# EasyEDA Pro project 温度报警器.eprj

# Schematic Schematic1
Create Date: 2024-07-26; Page Name: P1; Project Name: 温度报警器; Schematic Name: Schematic1; Update Date: 2024-07-29; Company: 嘉立创EDA; Page Size: A4; Version: V1.0
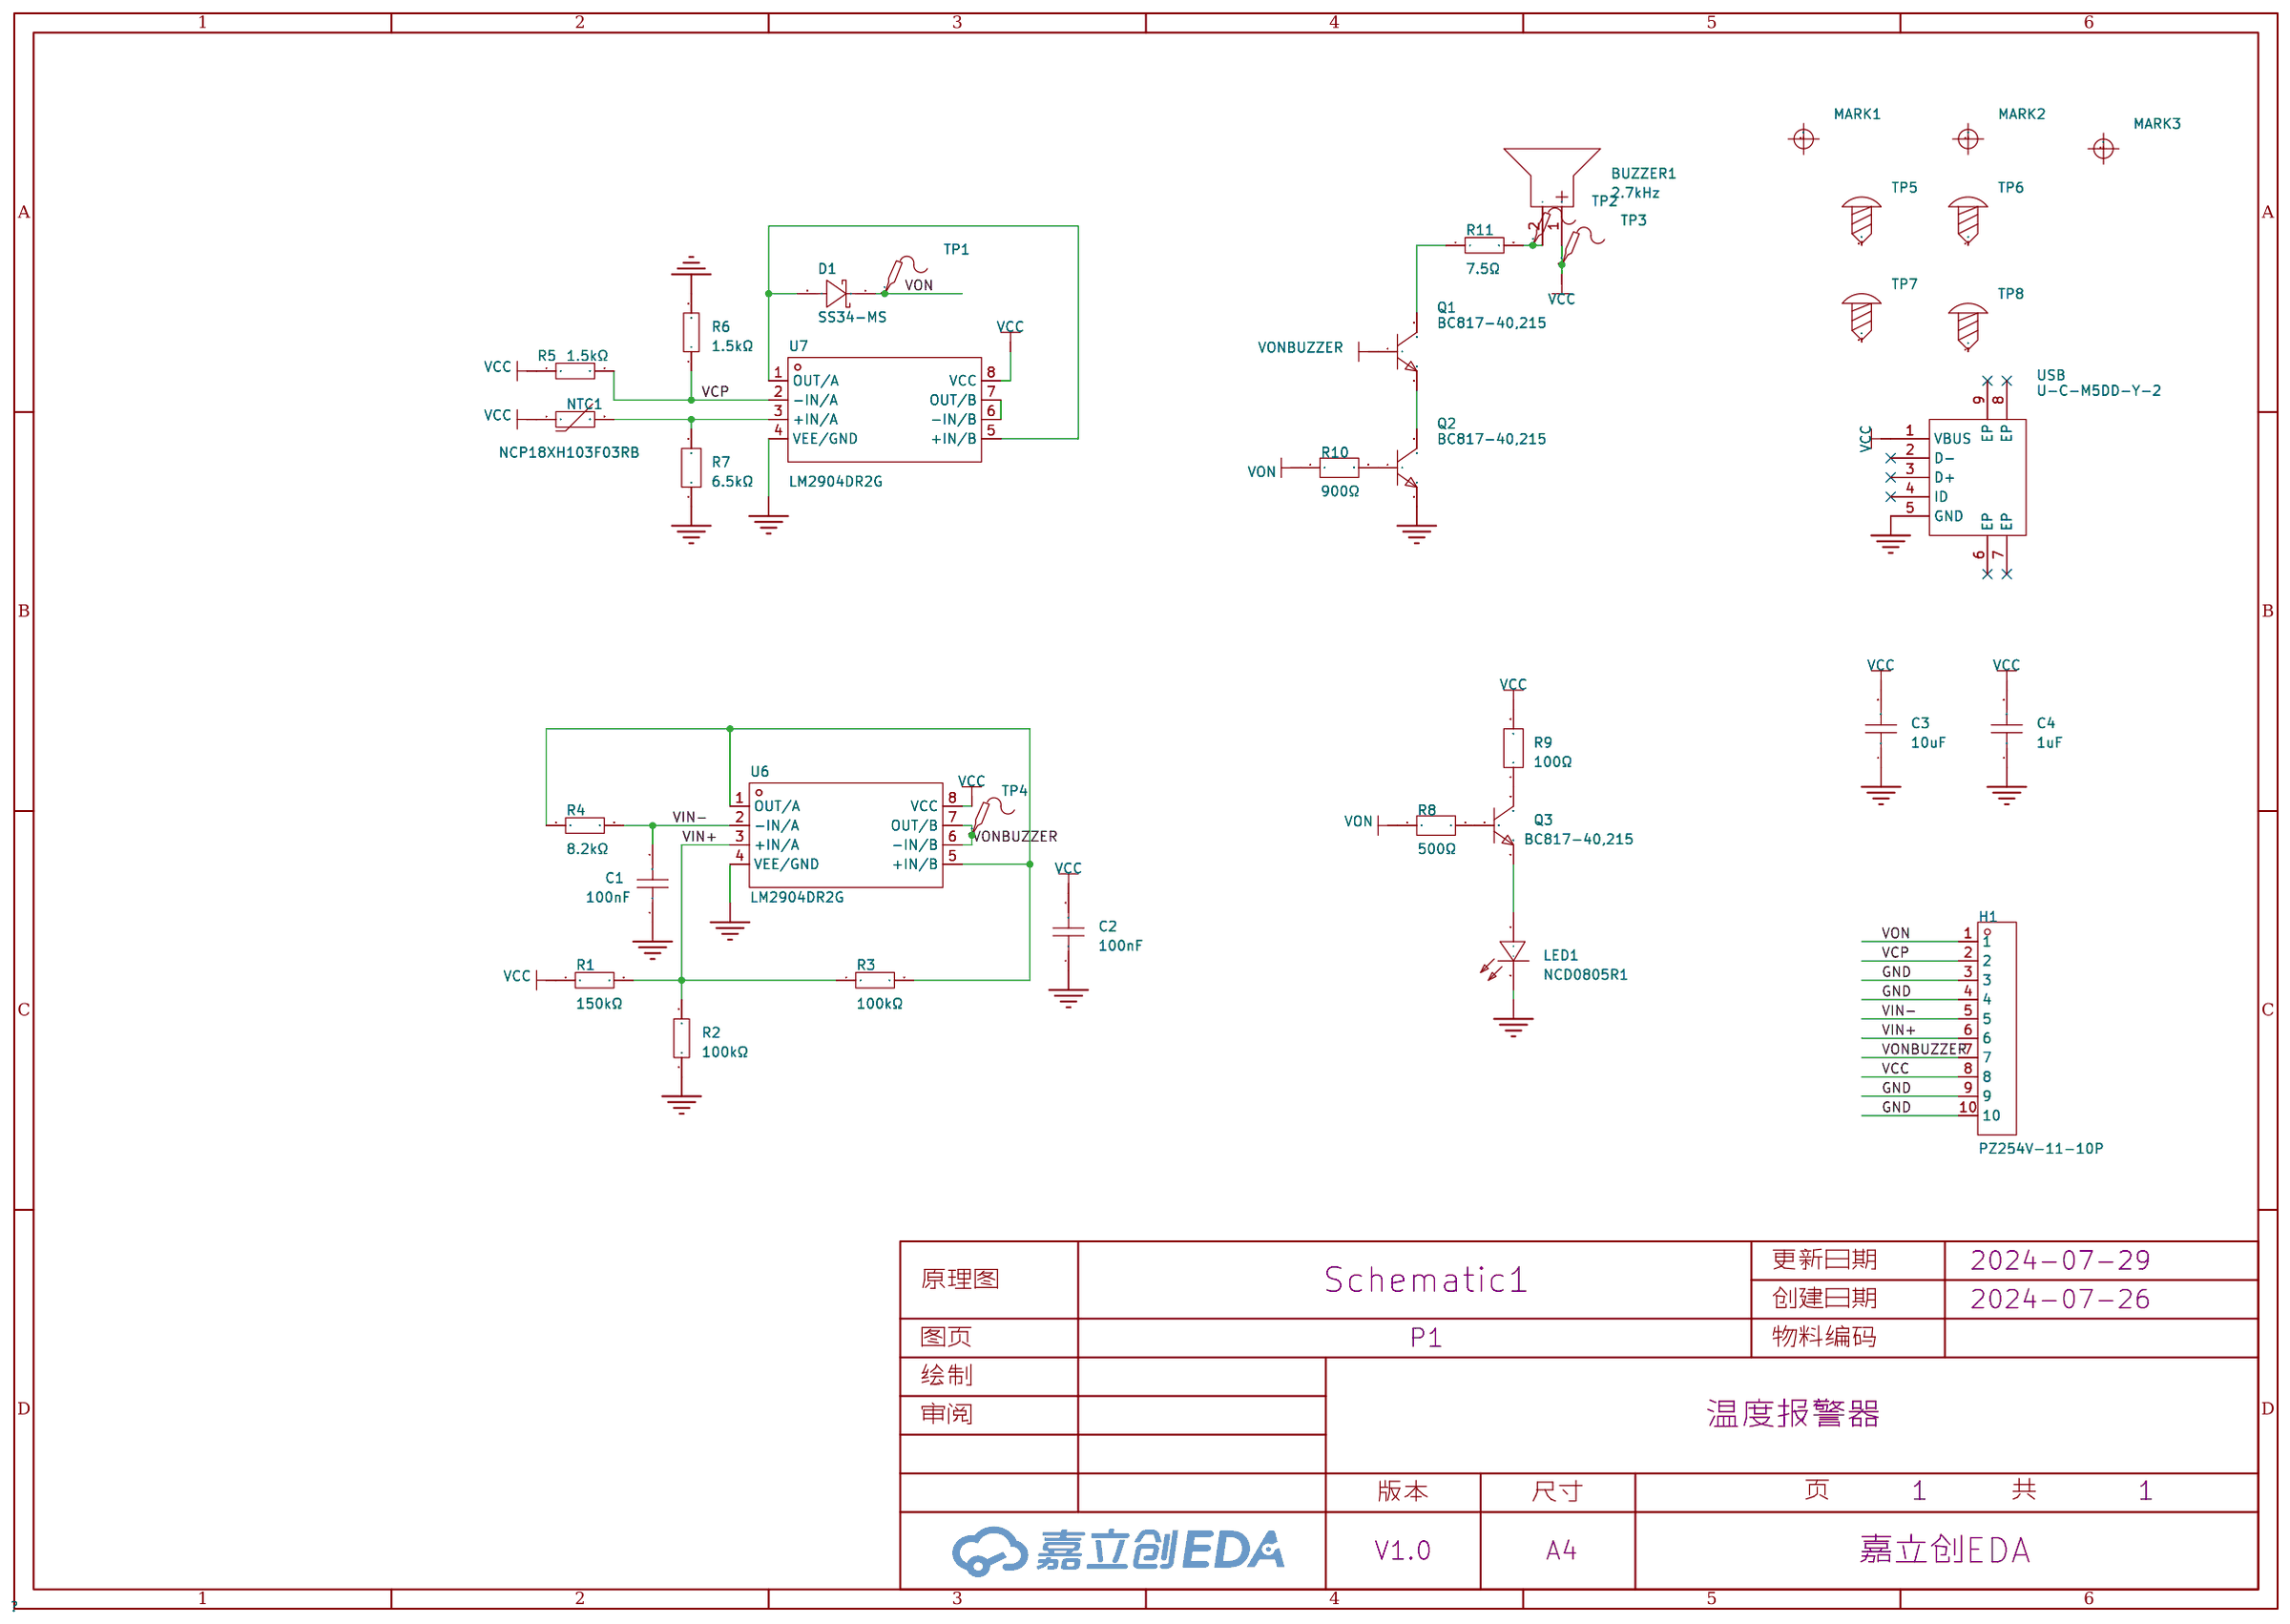
[diagram p0: schematic sheet]

## Parts
BUZZER1  2.7kHz  [BUZ-TH_BD9.0-P4.00-D0.6-FD]
C1  100nF  [C0603]
C2  100nF  [C0603]
C3  10uF  [C0603]
C4  1uF  [C0603]
D1  SS34-MS  [DO-214AC_L4.3-W2.7-LS5.0-RD]
H1  PZ254V-11-10P  [HDR-TH_10P-P2.54-V-M]
LED1  NCD0805R1  [LED0805-R-RD]
MARK1  -  [Mark-Point-1mm]  (no BOM)
MARK2  -  [Mark-Point-1mm]  (no BOM)
MARK3  -  [Mark-Point-1mm]  (no BOM)
NTC1  NCP18XH103F03RB  [R0603]
Q1  BC817-40,215  [SOT-23-3_L2.9-W1.6-P1.90-LS2.8-BR]
Q2  BC817-40,215  [SOT-23-3_L2.9-W1.6-P1.90-LS2.8-BR]
Q3  BC817-40,215  [SOT-23-3_L2.9-W1.6-P1.90-LS2.8-BR]
R1  150kΩ  [R0603]
R2  100kΩ  [R0603]
R3  100kΩ  [R0603]
R4  8.2kΩ  [R0603]
R5  1.5kΩ  [R0603]
R6  1.5kΩ  [R0603]
R7  6.5kΩ  [R0603]
R8  500Ω  [R0603]
R9  100Ω  [R0805]
R10  900Ω  [R0603]
R11  7.5Ω  [R1210]
TP1  -  [Test-Point-0.5mm]
TP2  -  [Test-Point-0.5mm]
TP3  -  [Test-Point-0.5mm]
TP4  -  [Test-Point-0.5mm]
TP5  -  [M3螺丝]
TP6  -  [M3螺丝]
TP7  -  [M3螺丝]
TP8  -  [M3螺丝]
U6  LM2904DR2G  [SOIC-8_L4.9-W3.9-P1.27-LS6.0-BL]
U7  LM2904DR2G  [SOIC-8_L4.9-W3.9-P1.27-LS6.0-BL]
USB  U-C-M5DD-Y-2  [MICRO-USB-SMD_U-C-M5DD-Y-2]

## Library data of the parts
BUZZER1 = YS-MBZ9042C05R42: 驱动方式:无源(外部驱动);构造类型:电磁式;频率:2.7kHz;声压(SPL):85dB@5V,10cm;; LCSC Part Name: 电磁式无源蜂鸣器5V; Supplier Part: C409837; Manufacturer: Fengming(锋鸣电子); Supplier Footprint: 插件,D=9mm; JLCPCB Part Class: 扩展库; Datasheet: https://atta.szlcsc.com/upload/public/pdf/source/20191217/C409837_893ADB678ED7E25111BC2D1A287FE6B1.pdf; Supplier: LCSC; Oscillator Circuit: 无源(外部驱动); Technology Type: 电磁式; Operating Voltage: 3V~7V; Sound Pressure Level (SPL): 85dB@5V,10cm; Diameter (φD): 9mm; Height: 4.4mm
C1 C2 = CC0603KRX7R9BB104: 容值:100nF;精度:±10%;额定电压:50V;材质(温度系数):X7R;; LCSC Part Name: 100nF ±10% 50V; Supplier Part: C14663; Manufacturer: YAGEO(国巨); Supplier Footprint: 0603; JLCPCB Part Class: Basic Part; Datasheet: https://atta.szlcsc.com/upload/public/pdf/source/20180910/C282072_33301C7F631E79921B82A8DAC6BCC5B3.pdf; Supplier: LCSC; Tolerance: ±10%; Voltage Rated: 50V; Temperature Coefficient: X7R
C3 = CL10A106KP8NNNC: 容值:10uF;精度:±10%;额定电压:10V;材质(温度系数):X5R;; LCSC Part Name: 10uF ±10% 10V; Supplier Part: C19702; Manufacturer: SAMSUNG(三星); Supplier Footprint: 0603; JLCPCB Part Class: 基础库; Datasheet: https://atta.szlcsc.com/upload/public/pdf/source/20160218/1457707763339.pdf; Supplier: LCSC; Tolerance: ±10%; Voltage Rated: 10V; Temperature Coefficient: X5R
C4 = CL10A105KB8NNNC: 容值:1uF;精度:±10%;额定电压:50V;材质(温度系数):X5R;; LCSC Part Name: 1uF ±10% 50V; Supplier Part: C15849; Manufacturer: SAMSUNG(三星); Supplier Footprint: 0603; JLCPCB Part Class: Basic Part; Datasheet: https://atta.szlcsc.com/upload/public/pdf/source/20160218/1457707763339.pdf; Supplier: LCSC; Tolerance: ±10%; Voltage Rated: 50V; Temperature Coefficient: X5R
D1 = SS34-MS: 二极管配置:-;正向压降(Vf):550mV@3A;直流反向耐压(Vr):40V;整流电流:3A;; LCSC Part Name: 电压:40V 电流:3A; Supplier Part: C2836396; Manufacturer: MSKSEMI(美森科); Supplier Footprint: SMA(DO-214AC); JLCPCB Part Class: 扩展库; Datasheet: https://atta.szlcsc.com/upload/public/pdf/source/20231010/B8429D209A8A83BAE11971393C9E7848.pdf; Supplier: LCSC; Forward Voltage (Vf@If): 550mV@3A; Reverse Voltage (Vr): 40V; Rectified Current: 3A; Reverse Leakage Current (Ir): 500uA@40V
H1 = PZ254V-11-10P: 插针结构:1x10P;间距:2.54mm;行距:-;圆针/方针:方针;安装类型:直插;排数:单排;总PIN位数:10P;额定电流:-;额定电压:-;配合针长度:6mm;塑高:2.5mm;端接针长度:3mm;触头材质:黄铜;触头镀层:-;工作温度范围:-40℃~+105℃;颜色:黑色;; LCSC Part Name: 间距:2.54mm 1x10P 直插 方针; Supplier Part: C492409; Manufacturer: XFCN(兴飞); Supplier Footprint: 插件,P=2.54mm; JLCPCB Part Class: Extended Part; Datasheet: https://atta.szlcsc.com/upload/public/pdf/source/20200309/C492409_129C9431BDD62EBBBD0A643B6AAB9FBD.pdf; Supplier: LCSC; Pin Structure: 1x10P; Pitch: 2.54mm; Circluar Pins/Square Pins: 方针; Mounting Type: 直插; Number of Rows: 单排; Number of Pins: 10P; Length of Mating Pin: 6mm; Insulation Height: 2.5mm; Length of End Connection Pin: 3mm; Contact Material: 黄铜; Operating Temperature Range: -40℃~+105℃; Color: 黑色
LED1 = NCD0805R1: 灯头类型:-;发光颜色:红色;正向电压(VF):1.6V~2.6V;功率:65mW;正向电流:20mA;主波长:615nm~630nm;二极管配置:独立二极管;透镜颜色:无色透明透镜;色温:-;发光强度:67mcd~195mcd;发光角度:130°;载带方式:-;工作温度:-30℃~+85℃;; Supplier Part: C84256; Manufacturer: 国星光电; Supplier Footprint: 0805; JLCPCB Part Class: Basic Part; Datasheet: https://atta.szlcsc.com/upload/public/pdf/source/20200820/C84256_F0A75A43B3EAD75808600A0514C76B99.pdf; Supplier: LCSC; Emitted Color: 红色; Forward Voltage (VF): 1.6V~2.6V; Power Dissipation: 65mW; Forward Current: 20mA; Dominant Wavelength: 615nm~630nm; Diode Configuration: 独立二极管; Lens Color: 无色透明透镜; Luminous Intensity: 67mcd~195mcd; Viewing Angle: 130°; Operating Temperature: -30℃~+85℃
MARK1-MARK3 = Mark-Point: Mark点
NTC1 = NCP18XH103F03RB: 阻值(25℃):10kΩ;B值(25℃/50℃):3380K;电阻精度:±1%;功率:100mW;B值精度:±1%;最大稳态电流(25℃):310uA;; LCSC Part Name: 10kΩ 电阻精度:±1% 3380K; Supplier Part: C13564; Manufacturer: muRata(村田); Supplier Footprint: 0603; JLCPCB Part Class: 扩展库; Datasheet: https://atta.szlcsc.com/upload/public/pdf/source/20130819/1457706638081.pdf; Supplier: LCSC; Resistance @ 25℃: 10kΩ; B Constant (25℃/50℃): 3380K; Resistance Tolerance: ±1%; B Constant (25℃/85℃): 3434K; B Constant (25℃/100℃): 3455K; Power: 100mW; B Constant Tolerance: ±1%; Steady State Current (Max): 310uA; Operating Temperature: -40℃~+125℃
Q1-Q3 = BC817-40,215: 晶体管类型:NPN;集电极电流(Ic):500mA;集射极击穿电压(Vceo):45V;功率(Pd):250mW;直流电流增益(hFE@Ic,Vce):250@100mA,1V;; LCSC Part Name: NPN 电流:500mA 耐压:45V hfe=250~600; Supplier Part: C52801; Manufacturer: Nexperia(安世); Supplier Footprint: SOT-23; JLCPCB Part Class: 扩展库; Datasheet: https://atta.szlcsc.com/upload/public/pdf/source/20160616/1466072039243.pdf; Supplier: LCSC; Transistor Type: NPN; Collector Current (Ic): 500mA; Collector-Emitter Breakdown Voltage (Vceo): 45V; Power Dissipation (Pd): 250mW; DC Current Gain (hFE@Ic,Vce): 250@100mA,1V; Transition Frequency (fT): 100MHz; Collector Cut-Off Current (Icbo): 100nA; Collector-Emitter Saturation Voltage (VCE(sat)@Ic,Ib): 700mV@500mA,50mA
R1 = 0603WAF1503T5E: 电阻类型:厚膜电阻;阻值:150kΩ;精度:±1%;功率:100mW;最大工作电压:75V;温度系数:±100ppm/℃;; LCSC Part Name: 150kΩ ±1% 100mW 厚膜电阻; Supplier Part: C22807; Manufacturer: UNI-ROYAL(厚声); Supplier Footprint: 0603; JLCPCB Part Class: 基础库; Datasheet: https://atta.szlcsc.com/upload/public/pdf/source/20200306/C422600_1E6D84923E4A46A82E41ADD87F860B5C.pdf; Supplier: LCSC; Type: 厚膜电阻; Tolerance: ±1%; Power(Watts): 100mW; Overload Voltage (Max): 75V; Temperature Coefficient: ±100ppm/℃; Operating Temperature Range: -55℃~+155℃
R2 R3 = 0603WAF1003T5E: 电阻类型:厚膜电阻;阻值:100kΩ;精度:±1%;功率:100mW;最大工作电压:75V;温度系数:±100ppm/℃;; LCSC Part Name: 100kΩ ±1% 100mW 厚膜电阻; Supplier Part: C25803; Manufacturer: UNI-ROYAL(厚声); Supplier Footprint: 0603; JLCPCB Part Class: Basic Part; Datasheet: https://atta.szlcsc.com/upload/public/pdf/source/20200306/C422600_1E6D84923E4A46A82E41ADD87F860B5C.pdf; Supplier: LCSC; Type: 厚膜电阻; Tolerance: ±1%; Power(Watts): 100mW; Overload Voltage (Max): 75V; Temperature Coefficient: ±100ppm/℃; Operating Temperature Range: -55℃~+155℃
R4 = 0603WAF8201T5E: 电阻类型:厚膜电阻;阻值:8.2kΩ;精度:±1%;功率:100mW;最大工作电压:75V;温度系数:±100ppm/℃;; LCSC Part Name: 8.2kΩ ±1% 100mW 厚膜电阻; Supplier Part: C25981; Manufacturer: UNI-ROYAL(厚声); Supplier Footprint: 0603; JLCPCB Part Class: 基础库; Datasheet: https://atta.szlcsc.com/upload/public/pdf/source/20200306/C422600_1E6D84923E4A46A82E41ADD87F860B5C.pdf; Supplier: LCSC; Type: 厚膜电阻; Tolerance: ±1%; Power(Watts): 100mW; Overload Voltage (Max): 75V; Temperature Coefficient: ±100ppm/℃; Operating Temperature Range: -55℃~+155℃
R5 R6 = 0603WAF1501T5E: 电阻类型:厚膜电阻;阻值:1.5kΩ;精度:±1%;功率:100mW;最大工作电压:75V;温度系数:±100ppm/℃;; LCSC Part Name: 1.5kΩ ±1% 100mW 厚膜电阻; Supplier Part: C22843; Manufacturer: UNI-ROYAL(厚声); Supplier Footprint: 0603; JLCPCB Part Class: 基础库; Datasheet: https://atta.szlcsc.com/upload/public/pdf/source/20200306/C422600_1E6D84923E4A46A82E41ADD87F860B5C.pdf; Supplier: LCSC; Type: 厚膜电阻; Tolerance: ±1%; Power(Watts): 100mW; Overload Voltage (Max): 75V; Temperature Coefficient: ±100ppm/℃; Operating Temperature Range: -55℃~+155℃
R7 = MCT06030D6501BP100: 电阻类型:薄膜电阻;阻值:6.5kΩ;精度:±0.1%;功率:100mW;最大工作电压:75V;温度系数:±25ppm/℃;; LCSC Part Name: 薄膜电阻 6.5kΩ ±0.1% 100mW; Supplier Part: C1707189; Manufacturer: VISHAY(威世); Supplier Footprint: 0603; JLCPCB Part Class: 扩展库; Datasheet: https://atta.szlcsc.com/upload/public/pdf/source/20210426/0BE53C245AFBBB1DABBADD6CC4094FB0.pdf; Supplier: LCSC; Type: 薄膜电阻; Tolerance: ±0.1%; Power(Watts): 100mW; Overload Voltage (Max): 75V; Temperature Coefficient: ±25ppm/℃; Operating Temperature Range: -55℃~+125℃
R8 = RT0603BRC07500RL: 电阻类型:薄膜电阻;阻值:500Ω;精度:±0.1%;功率:100mW;温度系数:±15ppm/℃;; LCSC Part Name: 薄膜电阻 500Ω ±0.1% 100mW; Supplier Part: C860931; Manufacturer: YAGEO(国巨); Supplier Footprint: 0603; JLCPCB Part Class: 扩展库; Supplier: LCSC; Type: 薄膜电阻; Tolerance: ±0.1%; Power(Watts): 100mW; Temperature Coefficient: ±15ppm/℃; Operating Temperature Range: -55℃~+155℃
R9 = ESR10EZPJ101: 电阻类型:厚膜电阻;阻值:100Ω;精度:±5%;功率:400mW;最大工作电压:150V;温度系数:±200ppm/℃;; LCSC Part Name: 厚膜电阻 100Ω ±5% 400mW; Supplier Part: C2846660; Manufacturer: ROHM(罗姆); Supplier Footprint: 0805; JLCPCB Part Class: 扩展库; Supplier: LCSC; Type: 厚膜电阻; Tolerance: ±5%; Power(Watts): 400mW; Overload Voltage (Max): 150V; Temperature Coefficient: ±200ppm/℃; Operating Temperature Range: -55℃~+155℃
R10 = SCR0603F900R: 电阻类型:厚膜电阻;阻值:900Ω;精度:±1%;功率:100mW;最大工作电压:75V;; LCSC Part Name: 厚膜电阻 900Ω ±1% 100mW; Supplier Part: C3016264; Manufacturer: VO(翔胜); Supplier Footprint: 0603; JLCPCB Part Class: 扩展库; Datasheet: https://atta.szlcsc.com/upload/public/pdf/source/20220513/247AF9639BA21CF93567DC289CCC6A22.pdf; Supplier: LCSC; Type: 厚膜电阻; Tolerance: ±1%; Power(Watts): 100mW; Overload Voltage (Max): 75V; Operating Temperature Range: -55℃~+155℃
R11 = 1210W2F750KT5E: 电阻类型:厚膜电阻;阻值:7.5Ω;精度:±1%;功率:500mW;最大工作电压:200V;温度系数:±200ppm/℃;; LCSC Part Name: 7.5Ω ±1% 500mW 厚膜电阻; Supplier Part: C55014; Manufacturer: UNI-ROYAL(厚声); Supplier Footprint: 1210; JLCPCB Part Class: Extended Part; Datasheet: https://atta.szlcsc.com/upload/public/pdf/source/20200306/C422600_1E6D84923E4A46A82E41ADD87F860B5C.pdf; Supplier: LCSC; Type: 厚膜电阻; Tolerance: ±1%; Power(Watts): 500mW; Overload Voltage (Max): 200V; Temperature Coefficient: ±200ppm/℃; Operating Temperature Range: -55℃~+155℃
TP1-TP4 = Test-Point: Test Point 测试点
TP5-TP8 = M3螺丝: Supplier Footprint: 插件
U6 U7 = LM2904DR2G: 放大器数:双路;增益带宽积(GBP):1MHz;输入偏置电流(Ib):45nA;压摆率(SR):-;带宽(-3db):-;; LCSC Part Name: 运算放大器，单电源，双路; Supplier Part: C18229; Manufacturer: onsemi(安森美); Supplier Footprint: SOIC-8; JLCPCB Part Class: 扩展库; Datasheet: https://atta.szlcsc.com/upload/public/pdf/source/20130828/1457706640962.pdf; Supplier: LCSC; Number of Circuits: 双路; Gain Bandwidth Product(GBP): 1MHz; Current - Input Bias(Ib): 45nA; Output Current: 40mA; Supply Current: 1.5mA; Operating Temperature: -40℃~+85℃
USB = U-C-M5DD-Y-2: 连接器类型:Micro-B;标准:USB 2.0;公母:母;端口数量:1;触点数量:5P;安装方式:沉板;额定电流 - 电源:1A;工作温度范围:-;; LCSC Part Name: Micro-B 母 沉板; Supplier Part: C2909201; Manufacturer: 韩国韩荣; Supplier Footprint: SMD; JLCPCB Part Class: 扩展库; Datasheet: https://atta.szlcsc.com/upload/public/pdf/source/20211029/CFD012A990AC3F24DD383C165F1BE152.pdf; Supplier: LCSC; Connector Type: Micro-B; Standard: USB 2.0; Gender: 母; Number of Ports: 1; Number of Contacts: 5P; Mounting Style: 沉板; Current Rating - Power (Max): 1A

## Nets
GND: C1.1 C2.1 C3.1 C4.1 H1.3 H1.4 H1.9 H1.10 LED1.2(-) Q2.2 R2.1 R6.2 R7.1 U6.4(VEE/GND) U7.4(VEE/GND) USB.5(GND)
VCC: BUZZER1.1(+) C2.2 C3.2 C4.2 H1.8 NTC1.1 R1.1 R5.1 R9.2 TP3.1 U6.8(VCC) U7.8(VCC) USB.1(VBUS)
VIN+: H1.6 R1.2 R2.2 R3.1 U6.3(+IN/A)
VIN-: C1.2 H1.5 R4.2 U6.2(-IN/A)
VCP: H1.2 R5.2 R6.1 U7.2(-IN/A)
VON: D1.1(A) H1.1 R8.1 R10.1 TP1.1
VONBUZZER: H1.7 Q1.1 TP4.1 U6.6(-IN/B) U6.7(OUT/B)
$1N940: NTC1.2 R7.2 U7.3(+IN/A)
$1N1853: Q1.3 R11.1
$1N1942: Q1.2 Q2.3
$1N3420: R3.2 R4.1 U6.1(OUT/A) U6.5(+IN/B)
$1N5155: Q2.1 R10.2
$1N5202: Q3.1 R8.2
$1N5206: LED1.1(+) Q3.2
$1N6093: U7.6(-IN/B) U7.7(OUT/B)
$1N6096: D1.2(K) U7.1(OUT/A) U7.5(+IN/B)
$1N6259: Q3.3 R9.1
$1N6307: BUZZER1.2(-) R11.2 TP2.1

Not connected (* = marked no-connect by the designer): MARK1 1; MARK2 1; MARK3 1; TP5 1; TP6 1; TP7 1; TP8 1; USB 2(D-)* 3(D+)* 4(ID)* 6(EP)* 7(EP)* 8(EP)* 9(EP)*

# Board PCB1
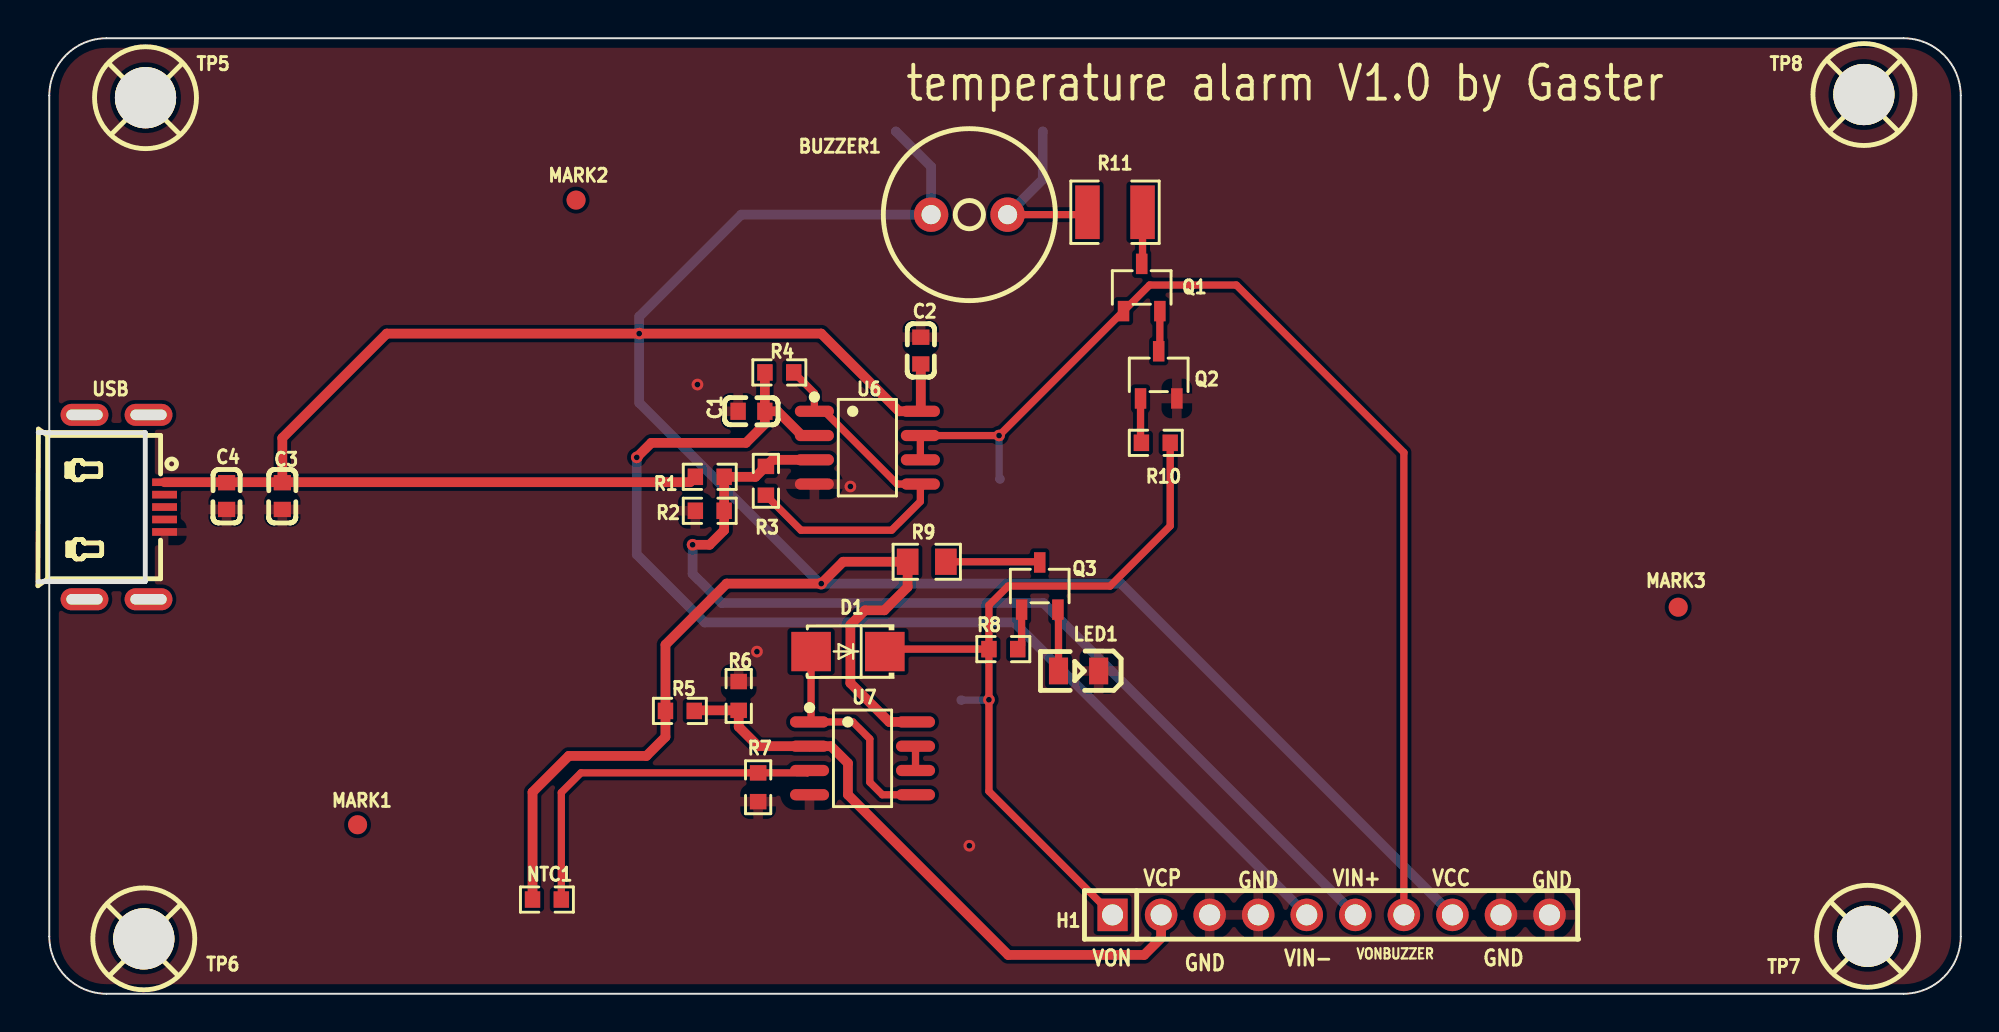
[diagram p1: board, top side]
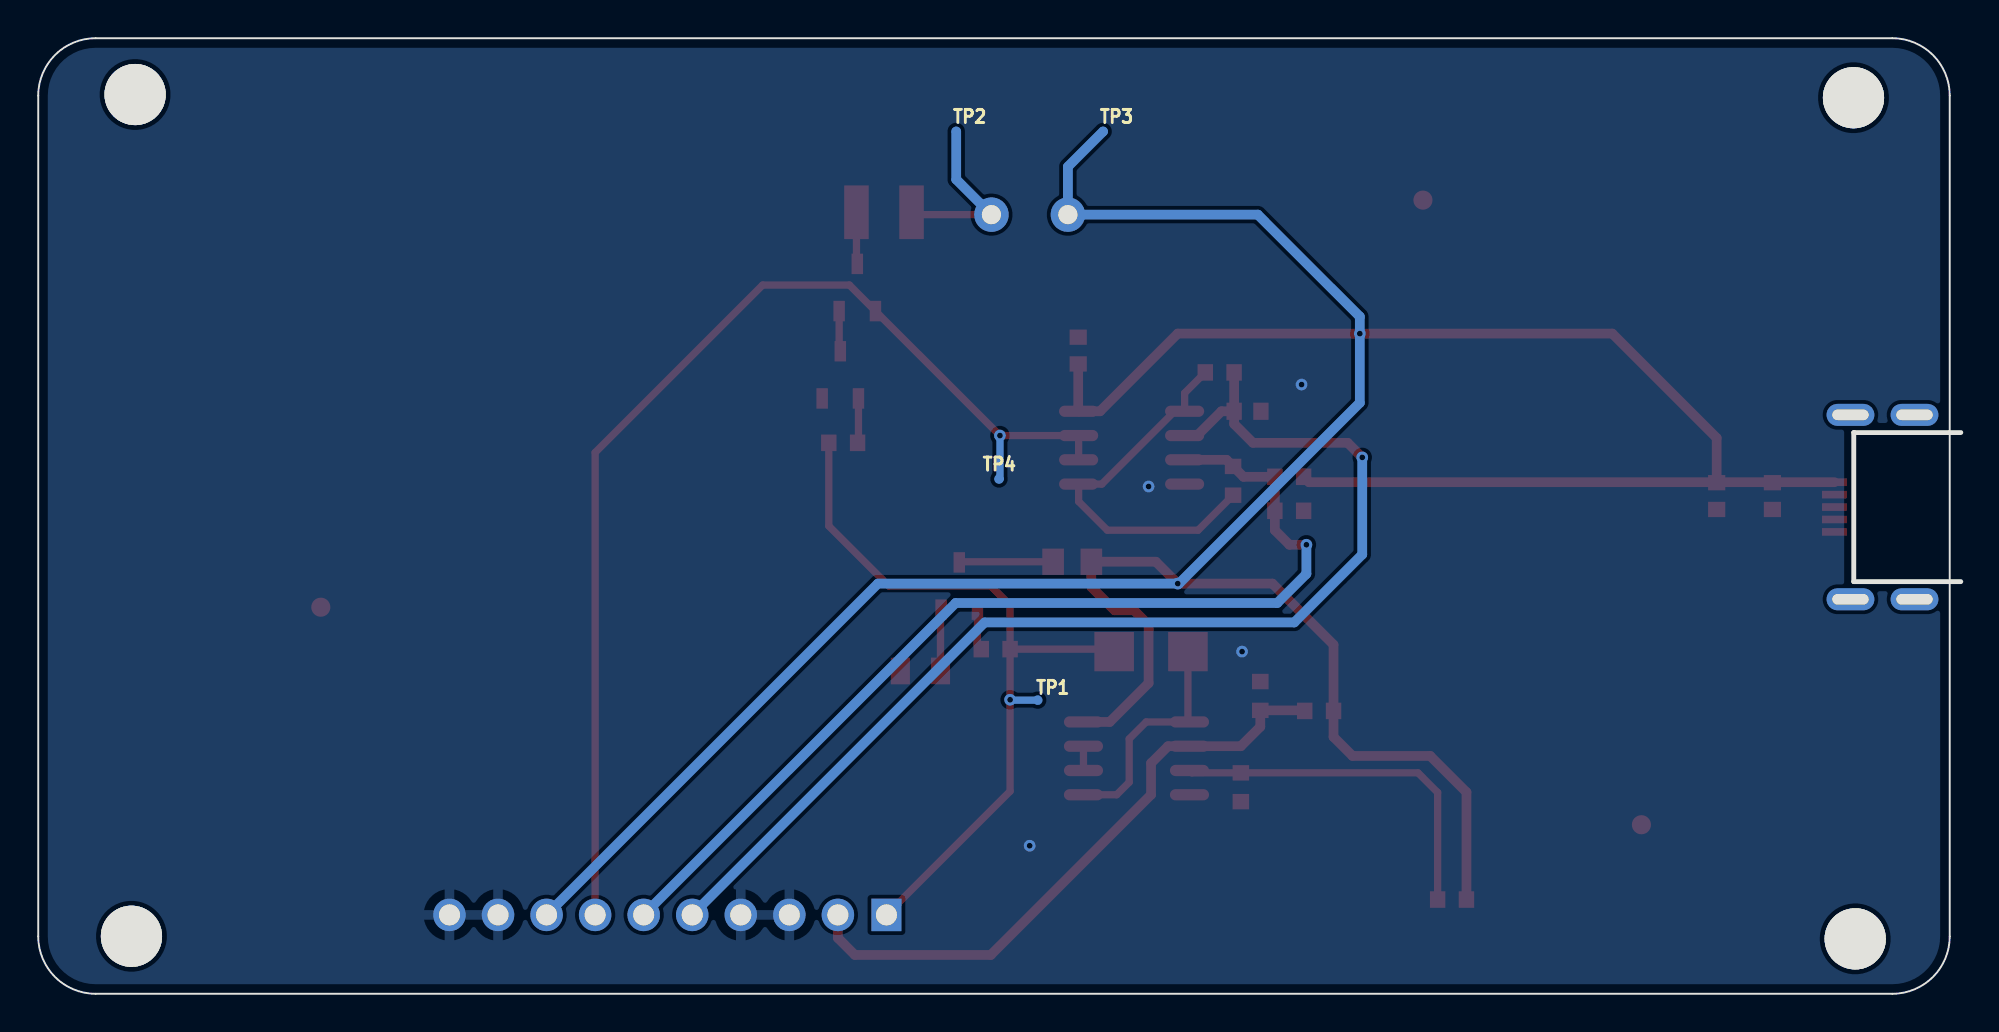
[diagram p2: board, bottom side, seen from below]

Outline 100.58 x 50 mm; copper layers: Top Layer, Bottom Layer. Coordinates in mm from the lower left corner of the outline.
Outline path: 0.58,47 0.58,3 arc(1.46,0.88) 3.58,0 97.58,0 arc(99.7,0.88) 100.58,3 100.58,47 arc(99.7,49.12) 97.58,50 3.58,50 arc(1.46,49.12) 0.58,47
Stack: Top Layer 0.035mm / Dielectric1 1.51mm FR4 er 4.5 / Bottom Layer 0.035mm

## Design rules (mm)
template: 自定义配置
spacing copperThickness1oz (default): track to track 0.203, other pairs 0.196 to 0.203
spacing copperThickness2oz: track to track 0.203, other pairs 0.152 to 0.3
spacing GND and VCC: track to track 0.203, other pairs 0.152 to 0.3
track width copperThickness1oz (default): min 0.254, default 0.381, max 0.762
track width copperThickness2oz: min 0.203, default 0.254, max 2.54
track width GND and VCC: min 0.508, default 0.508, max 0.762
differential pair differentialPair (default): width min 0.127, default 0.254, max 2.54; gap min 0.152, default 0.152
via viaSize (default): diameter min 0.5, default 0.61, max 10; hole min 0.3, default 0.305, max 6.299
net VCC uses GND and VCC
net GND uses GND and VCC

## Placement (name value [footprint] x y rotation side)
BUZZER1  2.7kHz  [BUZ-TH_BD9.0-P4.00-D0.6-FD]  48.71 40.77 0 top
C1  100nF  [C0603]  37.31 30.48 0 top
C2  100nF  [C0603]  46.17 33.66 270 top
C3  10uF  [C0603]  12.77 26.04 90 top
C4  1uF  [C0603]  9.85 26.04 90 top
D1  SS34-MS  [DO-214AC_L4.3-W2.7-LS5.0-RD]  42.36 17.91 180 top
H1  PZ254V-11-10P  [HDR-TH_10P-P2.54-V-M]  67.63 4.13 0 top
LED1  NCD0805R1  [LED0805-R-RD]  54.43 16.89 180 top
MARK1  -  [Mark-Point-1mm]  16.71 8.85 0 top
MARK2  -  [Mark-Point-1mm]  28.14 41.53 0 top
MARK3  -  [Mark-Point-1mm]  85.8 20.23 0 top
NTC1  NCP18XH103F03RB  [R0603]  26.61 4.93 0 top
Q1  BC817-40,215  [SOT-23-3_L2.9-W1.6-P1.90-LS2.8-BR]  57.73 36.96 270 top
Q2  BC817-40,215  [SOT-23-3_L2.9-W1.6-P1.90-LS2.8-BR]  58.62 32.39 270 top
Q3  BC817-40,215  [SOT-23-3_L2.9-W1.6-P1.90-LS2.8-BR]  52.39 21.34 270 top
R1  150kΩ  [R0603]  35.13 27.05 0 top
R2  100kΩ  [R0603]  35.13 25.27 0 top
R3  100kΩ  [R0603]  38.07 26.84 270 top
R4  8.2kΩ  [R0603]  38.77 32.51 180 top
R5  1.5kΩ  [R0603]  33.57 14.8 0 top
R6  1.5kΩ  [R0603]  36.65 15.58 90 top
R7  6.5kΩ  [R0603]  37.66 10.81 90 top
R8  500Ω  [R0603]  50.49 18.03 0 top
R9  100Ω  [R0805]  46.48 22.61 180 top
R10  900Ω  [R0603]  58.47 28.83 180 top
R11  7.5Ω  [R1210]  56.33 40.89 180 top
TP1  -  [Test-Point-0.5mm]  48.29 15.36 180 bottom
TP2  -  [Test-Point-0.5mm]  52.55 45.12 180 bottom
TP3  -  [Test-Point-0.5mm]  44.87 45.12 180 bottom
TP4  -  [Test-Point-0.5mm]  50.31 26.94 180 bottom
TP5  -  [M3螺丝]  5.68 46.82 0 top
TP6  -  [M3螺丝]  5.59 2.81 0 top
TP7  -  [M3螺丝]  95.76 2.95 0 top
TP8  -  [M3螺丝]  95.57 46.99 0 top
U6  LM2904DR2G  [SOIC-8_L4.9-W3.9-P1.27-LS6.0-BL]  43.38 28.58 270 top
U7  LM2904DR2G  [SOIC-8_L4.9-W3.9-P1.27-LS6.0-BL]  43.12 12.32 270 top
USB  U-C-M5DD-Y-2  [MICRO-USB-SMD_U-C-M5DD-Y-2]  4.52 25.47 270 top

## Footprints (pads in the part's own frame, mm; a bottom-side part is the same pattern mirrored in y, then rotated)
BUZ-TH_BD9.0-P4.00-D0.6-FD
  round 1.8 hole 1: 1(-2,0) 2(2,0)
C0603
  rect 0.8x0.9 smd: 1(-0.7,0) 2(0.7,0)
DO-214AC_L4.3-W2.7-LS5.0-RD
  rect 2.07x2.06 smd: 1(-1.929,0) 2(1.929,0)
HDR-TH_10P-P2.54-V-M
  rect 1.575x1.7 hole 1.1: 1(-11.43,0)
  round 1.7 hole 1.1: 2(-8.89,0) 3(-6.35,0) 4(-3.81,0) 5(-1.27,0) 6(1.27,0) 7(3.81,0) 8(6.35,0) 9(8.89,0) 10(11.43,0)
LED0805-R-RD
  rect 1x1.399 smd: 1(1.05,0) 2(-1.05,0)
M3螺丝
  round 3.2 hole 3.2: 1(-0.064,0.064)
Mark-Point-1mm
  round 1 smd: 1(0,0)
MICRO-USB-SMD_U-C-M5DD-Y-2
  rect 0.4x1.3 smd: 1(-1.301,2.095) 2(-0.65,2.095) 3(-0.001,2.095) 4(0.649,2.095) 5(1.3,2.095)
  oval 1.15x2.5 hole 0.55x1.9: 6(4.825,1.256) 7(4.825,-2.095) 8(-4.825,-2.095) 9(-4.825,1.256)
R0603
  rect 0.806x0.864 smd: 1(-0.753,0) 2(0.753,0)
R0805
  rect 1.133x1.377 smd: 1(-1,0) 2(1,0)
R1210
  rect 1.282x2.808 smd: 1(-1.441,0) 2(1.441,0)
SOIC-8_L4.9-W3.9-P1.27-LS6.0-BL
  oval 0.588x2.045 smd: 1(-1.905,-2.772) 2(-0.635,-2.772) 3(0.635,-2.772) 4(1.905,-2.772) 5(1.905,2.772) 6(0.635,2.772) 7(-0.635,2.772) 8(-1.905,2.772)
SOT-23-3_L2.9-W1.6-P1.90-LS2.8-BR
  rect 1.07x0.6 smd: 1(1.235,-0.95) 2(1.235,0.95) 3(-1.235,0)
Test-Point-0.5mm
  round 0.5 smd: 1(0,0)

## Nets
As in the schematic.

Pads without a net: MARK1 1; MARK2 1; MARK3 1; TP5 1; TP6 1; TP7 1; TP8 1; USB 2 3 4 6 7 8 9

## Via types
v1: diameter 0.61, hole 0.305, Top Layer to Bottom Layer, 10 vias

## Routing (per net, layer and track width the routed paths; a pad name or vN(x,y) marks a point on that pad's centre or on a via; arc(x,y) is an arc through that point)
GND:
  vias: v1(34.49,31.88) v1(37.6,17.91) v1(42.49,26.54) v1(48.71,7.75)
VCC: length 196.3
  Top Layer w0.508: 12.77,26.77 12.77,29.08 18.23,34.54 v1(31.44,34.54) 40.96,34.54 45.03,30.48 U6.8 46.17,30.5 C2.2 ; 12.77,26.77 9.83,26.77 ; 12.77,26.77 12.8,26.77 ; 9.83,26.77 C4.2 ; 9.83,26.77 USB.1 ; NTC1.1 25.86,10.55 27.76,12.45 31.82,12.45 32.81,13.44 R5.1 32.81,18.27 36.01,21.46 v1(40.96,21.46) 42.11,22.61 R9.2 45.48,21.28 44.27,20.07 43.25,20.07 42.49,19.3 42.49,16.26 44.52,14.22 U7.8 ; R1.1 34.09,26.77 12.8,26.77 ; C3.2 12.8,26.77
  Bottom Layer w0.508: TP3.1 46.71,43.28 BUZZER1.1 36.77,40.77 31.44,35.43 v1(31.44,34.54) 31.44,30.92 40.9,21.46 v1(40.96,21.46) 56.65,21.46 H1.8
VIN+: length 53.4
  Top Layer w0.508: v1(34.23,23.5) 35.12,23.5 35.88,24.26 R2.2 R1.2 37.52,27.05 R3.1 38.41,27.94 U6.3
  Bottom Layer w0.508: H1.6 52.58,20.45 35.76,20.45 34.23,21.97 v1(34.23,23.5)
VIN-: length 61.2
  Top Layer w0.508: C1.2 38.68,30.48 39.95,29.21 U6.2 ; C1.2 38.01,32.51 R4.2 ; C1.2 38.01,29.82 37.03,28.83 32.07,28.83 v1(31.31,28.07)
  Bottom Layer w0.508: H1.5 51.06,19.43 34.87,19.43 31.31,22.99 v1(31.31,28.07)
VCP: length 33.1
  Top Layer w0.381: H1.2 58.39,4.13
  Top Layer w0.508: R5.2 34.35,14.83 R6.1 36.65,13.97 37.66,12.95 U7.2 41.47,12.95 42.36,12.07 42.36,10.41 50.74,2.03 57.85,2.03 58.74,2.92 H1.2
VON: length 41.4
  Top Layer w0.381: D1.1 44.42,18.03 R8.1 ; R10.1 59.22,24.48 56.08,21.34 50.74,21.34 49.74,20.33 R8.1 ; R8.1 v1(49.74,15.39) 49.74,10.6 H1.1
  Bottom Layer w0.381: TP1.1 49.71,15.36 v1(49.74,15.39)
VONBUZZER: length 60
  Top Layer w0.381: U6.6 U6.7 v1(50.27,29.21) Q1.1 58.14,37.08 62.68,37.08 71.44,28.32 H1.7
  Bottom Layer w0.381: v1(50.27,29.21) 50.27,26.94 TP4.1
$1N940: length 19.1
  Top Layer w0.381: U7.3 40.23,11.56 R7.2 28.39,11.56 27.37,10.53 NTC1.2
$1N1853: length 2.7
  Top Layer w0.381: R11.1 57.77,38.24 Q1.3
$1N1942: length 2.1
  Top Layer w0.381: Q1.2 58.68,33.68 Q2.3
$1N3420: length 20
  Top Layer w0.381: R4.1 40.6,31.43 U6.1 41.13,30.48 44.94,26.67 U6.5 46.15,25.76 44.65,24.26 39.9,24.26 38.07,26.09
$1N5155: length 2.3
  Top Layer w0.381: Q2.1 57.67,28.87 R10.2
$1N5202: length 2.2
  Top Layer w0.381: Q3.1 51.44,18.24 R8.2
$1N5206: length 3.2
  Top Layer w0.381: Q3.2 53.38,20.07 LED1.1
$1N6093: length 1.3
  Top Layer w0.381: U7.7 U7.6
$1N6096: length 12.2
  Top Layer w0.381: D1.2 40.43,14.31 U7.1 42.62,14.22 43.5,13.34 43.5,11.07 44.16,10.41 U7.5
$1N6259: length 4.9
  Top Layer w0.381: Q3.3 52.36,22.61 R9.1
$1N6307: length 9.3
  Top Layer w0.381: BUZZER1.2 54.76,40.77 R11.2
  Bottom Layer w0.508: BUZZER1.2 52.55,42.61 TP2.1

## Copper pours and planes (outline as drawn; the poured copper is in the pictures)
GND on Top Layer: 0.32,50.42 101.29,50.42 101.29,-0.13 0.32,-0.13
GND on Bottom Layer: 0.07,50.29 101.42,50.29 101.42,-0.63 0.07,-0.63

## Text on the board
Top Silkscreen Layer: VONBUZZER | VON | VCP | GND | VIN- | VIN+ | VCC | temperature alarm V1.0 by Gaster
